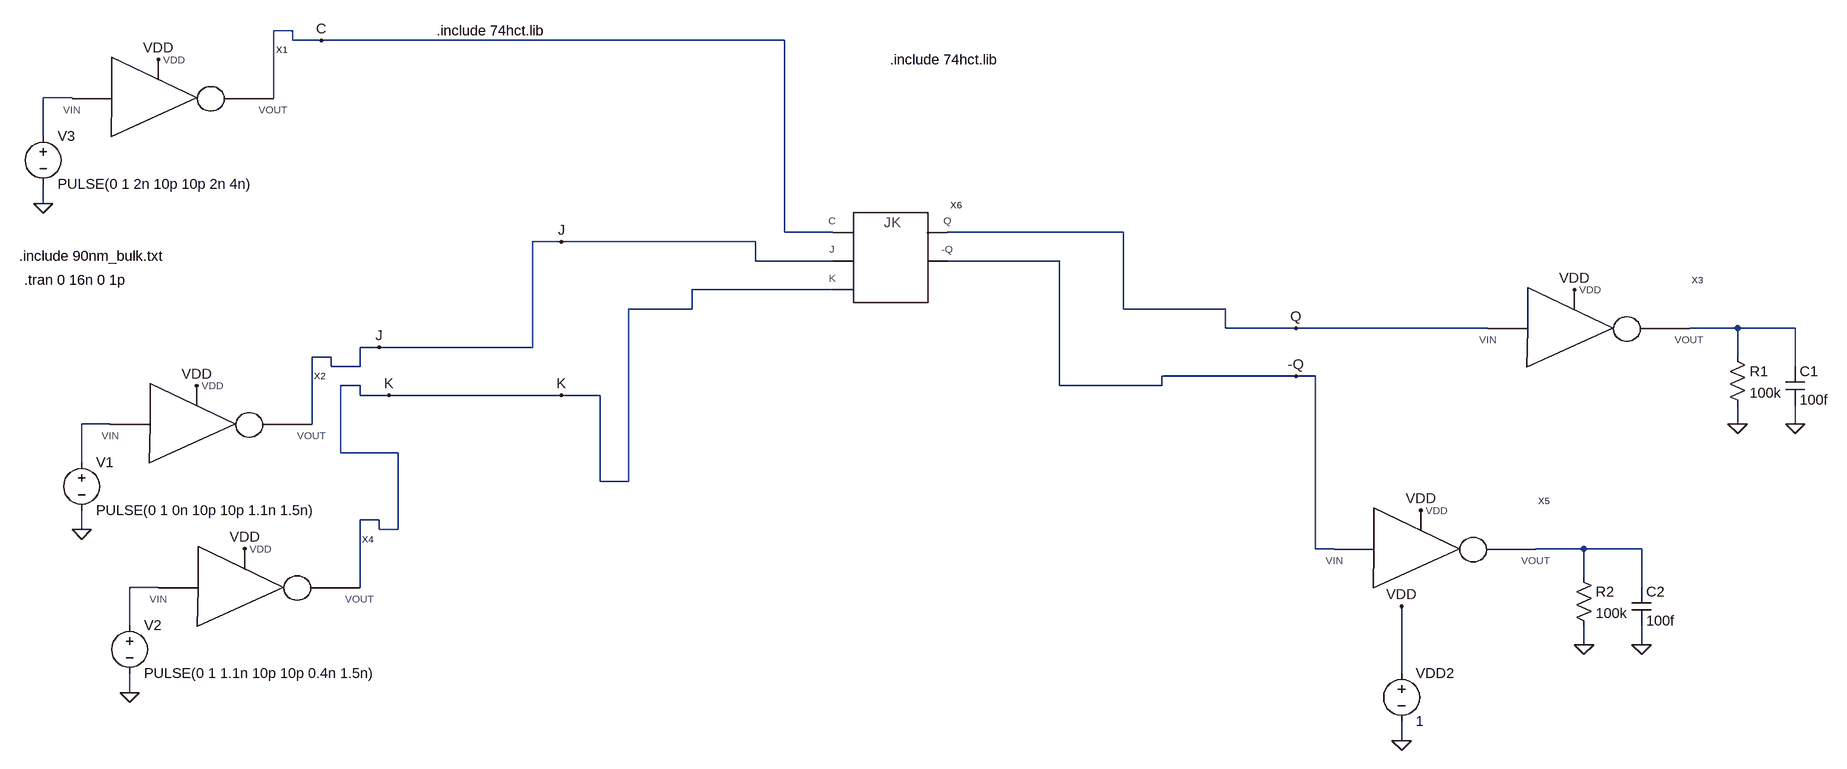
[diagram p0: schematic JKtriggertest.asc]
JKtriggertest.asc, the LTspice schematic file:
Version 4
SHEET 1 4652 836
WIRE 800 -400 768 -400
WIRE 800 -384 800 -400
WIRE 848 -384 800 -384
WIRE 1888 -384 848 -384
WIRE 432 -288 384 -288
WIRE 768 -288 768 -400
WIRE 384 -224 384 -288
WIRE 384 -112 384 -144
WIRE 1888 -64 1888 -384
WIRE 1968 -64 1888 -64
WIRE 2800 -64 2160 -64
WIRE 1248 -48 1200 -48
WIRE 1840 -48 1248 -48
WIRE 1840 -16 1840 -48
WIRE 1968 -16 1840 -16
WIRE 2560 -16 2160 -16
WIRE 1968 32 1664 32
WIRE 1664 64 1664 32
WIRE 1664 64 1360 64
WIRE 2800 64 2800 -64
WIRE 3008 64 2800 64
WIRE 3008 96 3008 64
WIRE 3136 96 3008 96
WIRE 3456 96 3136 96
WIRE 3872 96 3792 96
WIRE 3968 96 3872 96
WIRE 944 128 912 128
WIRE 1200 128 1200 -48
WIRE 1200 128 944 128
WIRE 864 144 832 144
WIRE 3872 144 3872 96
WIRE 864 160 864 144
WIRE 912 160 912 128
WIRE 912 160 864 160
WIRE 3968 160 3968 96
WIRE 3136 176 2864 176
WIRE 3168 176 3136 176
WIRE 912 192 880 192
WIRE 2560 192 2560 -16
WIRE 2864 192 2864 176
WIRE 2864 192 2560 192
WIRE 912 208 912 192
WIRE 960 208 912 208
WIRE 1248 208 960 208
WIRE 1312 208 1248 208
WIRE 496 256 448 256
WIRE 832 256 832 144
WIRE 3872 256 3872 224
WIRE 3968 256 3968 224
WIRE 880 304 880 192
WIRE 976 304 880 304
WIRE 448 320 448 256
WIRE 1312 352 1312 208
WIRE 1360 352 1360 64
WIRE 1360 352 1312 352
WIRE 944 416 912 416
WIRE 448 432 448 400
WIRE 944 432 944 416
WIRE 976 432 976 304
WIRE 976 432 944 432
WIRE 3168 464 3168 176
WIRE 3200 464 3168 464
WIRE 3616 464 3536 464
WIRE 3712 464 3616 464
WIRE 3616 512 3616 464
WIRE 576 528 528 528
WIRE 912 528 912 416
WIRE 3712 528 3712 464
WIRE 528 592 528 528
WIRE 3616 624 3616 592
WIRE 3712 624 3712 592
WIRE 3312 672 3312 560
WIRE 528 704 528 672
WIRE 3312 784 3312 752
FLAG 3872 256 0
FLAG 3968 256 0
FLAG 3600 32 VDD
FLAG 3312 560 VDD
FLAG 3312 784 0
FLAG 3616 624 0
FLAG 3712 624 0
FLAG 3344 400 VDD
FLAG 944 128 J
FLAG 960 208 K
FLAG 3136 96 Q
FLAG 3136 176 -Q
FLAG 384 -112 0
FLAG 576 -352 VDD
FLAG 848 -384 C
FLAG 1248 -48 J
FLAG 1248 208 K
FLAG 448 432 0
FLAG 640 192 VDD
FLAG 528 704 0
FLAG 720 464 VDD
SYMBOL res 3856 128 R0
SYMATTR InstName R1
SYMATTR Value 100k
SYMBOL cap 3952 160 R0
SYMATTR InstName C1
SYMATTR Value 100f
SYMBOL inverter 3584 96 R0
SYMATTR InstName X3
SYMBOL voltage 3312 656 R0
WINDOW 123 0 0 Left 2
WINDOW 39 0 0 Left 2
SYMATTR InstName VDD2
SYMATTR Value 1
SYMBOL res 3600 496 R0
SYMATTR InstName R2
SYMATTR Value 100k
SYMBOL cap 3696 528 R0
SYMATTR InstName C2
SYMATTR Value 100f
SYMBOL inverter 3328 464 R0
SYMATTR InstName X5
SYMBOL voltage 384 -240 R0
WINDOW 123 0 0 Left 2
WINDOW 39 0 0 Left 2
SYMATTR InstName V3
SYMATTR Value PULSE(0 1 2n 10p 10p 2n 4n)
SYMBOL inverter 560 -288 R0
SYMATTR InstName X1
SYMBOL jkt 2064 -16 R0
SYMATTR InstName X6
SYMBOL voltage 448 304 R0
WINDOW 123 0 0 Left 2
WINDOW 39 0 0 Left 2
SYMATTR InstName V1
SYMATTR Value PULSE(0 1 0n 10p 10p 1.1n 1.5n)
SYMBOL inverter 624 256 R0
SYMATTR InstName X2
SYMBOL voltage 528 576 R0
WINDOW 123 0 0 Left 2
WINDOW 39 0 0 Left 2
SYMATTR InstName V2
SYMATTR Value PULSE(0 1 1.1n 10p 10p 0.4n 1.5n)
SYMBOL inverter 704 528 R0
SYMATTR InstName X4
TEXT 352 16 Left 2 !.tran 0 16n 0 1p
TEXT 344 -24 Left 2 !.include 90nm_bulk.txt
TEXT 1040 -400 Left 2 !.include 74hct.lib
TEXT 2064 -352 Left 2 !.include 74hct.lib

The netlist it stands for:
* JKtriggertest.asc
R1 N002 0 100k
C1 N002 0 100f
XX3 Q N002 VDD inverter  ; pins VIN VOUT VDD
VDD2 VDD 0 1
R2 N004 0 100k
C2 N004 0 100f
XX5 -Q N004 VDD inverter  ; pins VIN VOUT VDD
V3 N001 0 PULSE(0 1 2n 10p 10p 2n 4n)
XX1 N001 C VDD inverter  ; pins VIN VOUT VDD
XX6 C J K Q -Q jkt  ; pins C J K Q -Q
V1 N003 0 PULSE(0 1 0n 10p 10p 1.1n 1.5n)
XX2 N003 J VDD inverter  ; pins VIN VOUT VDD
V2 N005 0 PULSE(0 1 1.1n 10p 10p 0.4n 1.5n)
XX4 N005 K VDD inverter  ; pins VIN VOUT VDD
.tran 0 16n 0 1p
.include 90nm_bulk.txt
.include 74hct.lib
.include 74hct.lib
.backanno
.end

* Results of the author's LTspice run, read from the files saved beside the schematic
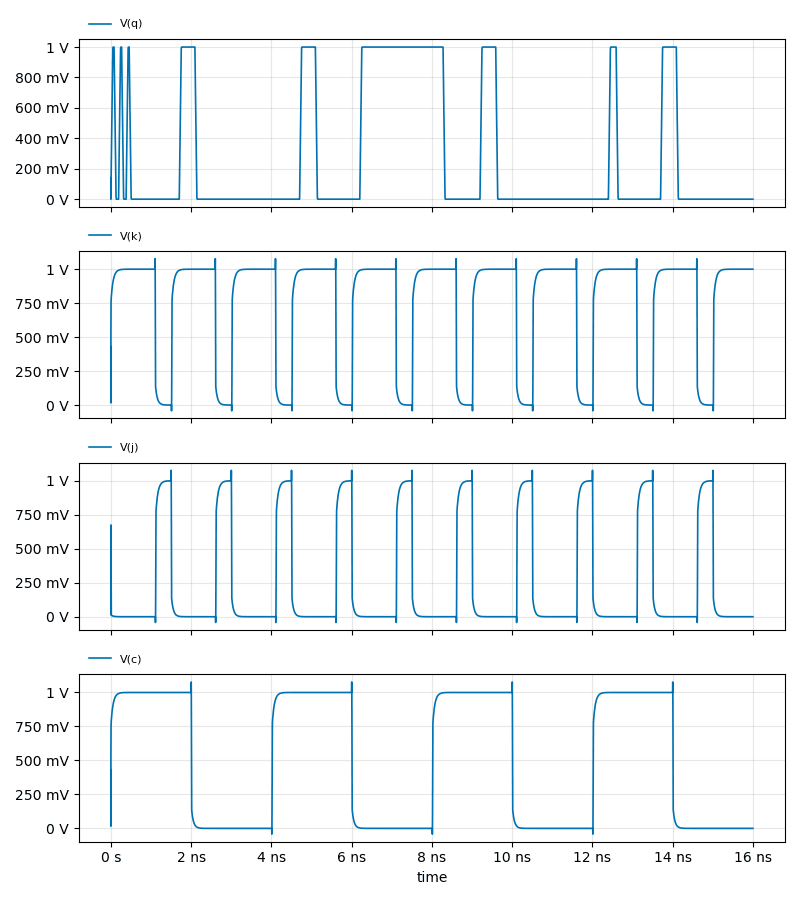
[diagram p1: Transient Analysis of JKtriggertest.asc, plotted from the saved traces]
* Transient Analysis, 1 run:
*   V(q): min 0 V, max 1 V, average 254.1 mV, rms 495 mV, last 0 V
*   V(k): min -42.11 mV, max 1.077 V, average 738.7 mV, rms 851.9 mV, last 999.8 mV
*   V(j): min -42.22 mV, max 1.077 V, average 240.1 mV, rms 477.1 mV, last 89.15 µV
*   V(c): min -42.16 mV, max 1.077 V, average 497 mV, rms 701.4 mV, last 81.04 µV